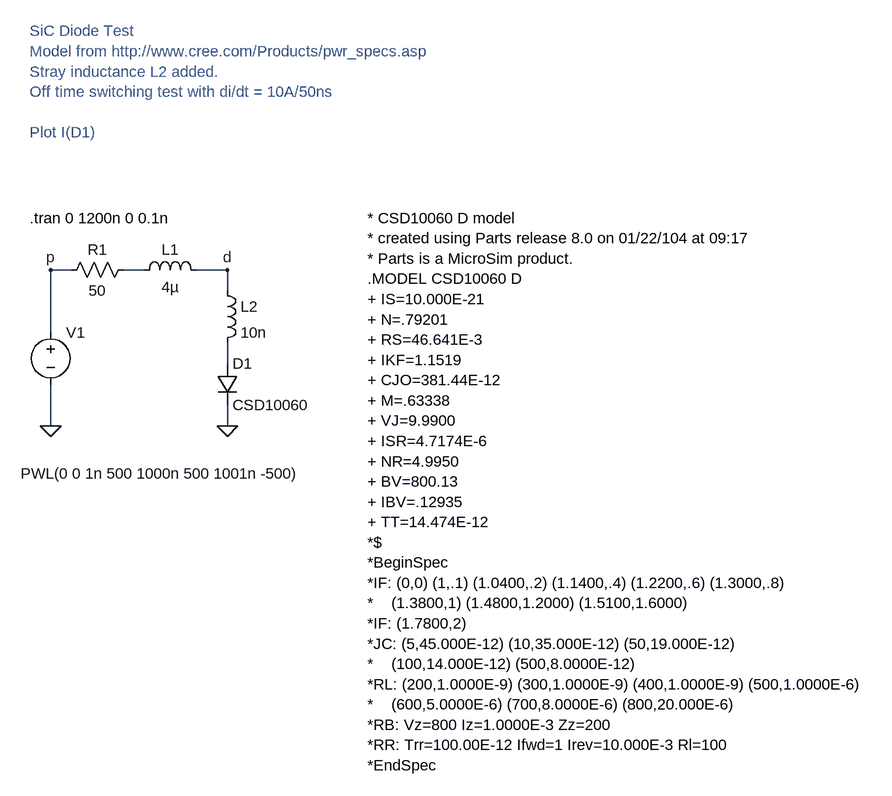
[diagram p0: schematic csd10060_test.asc]
csd10060_test.asc, the LTspice schematic file:
Version 4
SHEET 1 1156 820
WIRE 80 224 80 256
WIRE 80 160 80 128
WIRE 80 16 32 16
WIRE -160 16 -192 16
WIRE -192 16 -192 112
WIRE -192 192 -192 256
WIRE -48 16 -80 16
WIRE 80 48 80 16
FLAG 80 256 0
FLAG -192 256 0
FLAG 80 16 d
FLAG -192 16 p
SYMBOL diode 64 160 R0
SYMATTR InstName D1
SYMATTR Value CSD10060
SYMBOL res -176 32 R270
WINDOW 0 32 56 VTop 0
WINDOW 3 0 56 VBottom 0
SYMATTR InstName R1
SYMATTR Value 50
SYMBOL voltage -192 96 R0
WINDOW 3 -46 233 Left 0
WINDOW 123 0 0 Left 0
WINDOW 39 0 0 Left 0
SYMATTR Value PWL(0 0 1n 500 1000n 500 1001n -500)
SYMATTR InstName V1
SYMBOL ind -64 32 R270
WINDOW 0 32 56 VTop 0
WINDOW 3 5 56 VBottom 0
SYMATTR InstName L1
SYMATTR Value 4µ
SYMBOL ind 64 32 R0
SYMATTR InstName L2
SYMATTR Value 10n
TEXT 296 -64 Left 0 !* CSD10060 D model\n* created using Parts release 8.0 on 01/22/104 at 09:17\n* Parts is a MicroSim product.\n.MODEL CSD10060 D\n+ IS=10.000E-21\n+ N=.79201\n+ RS=46.641E-3\n+ IKF=1.1519\n+ CJO=381.44E-12\n+ M=.63338\n+ VJ=9.9900\n+ ISR=4.7174E-6\n+ NR=4.9950\n+ BV=800.13\n+ IBV=.12935\n+ TT=14.474E-12\n*$\n*BeginSpec\n*IF: (0,0) (1,.1) (1.0400,.2) (1.1400,.4) (1.2200,.6) (1.3000,.8) \n*    (1.3800,1) (1.4800,1.2000) (1.5100,1.6000)\n*IF: (1.7800,2)\n*JC: (5,45.000E-12) (10,35.000E-12) (50,19.000E-12) \n*    (100,14.000E-12) (500,8.0000E-12)\n*RL: (200,1.0000E-9) (300,1.0000E-9) (400,1.0000E-9) (500,1.0000E-6)\n*    (600,5.0000E-6) (700,8.0000E-6) (800,20.000E-6)\n*RB: Vz=800 Iz=1.0000E-3 Zz=200\n*RR: Trr=100.00E-12 Ifwd=1 Irev=10.000E-3 Rl=100\n*EndSpec
TEXT -224 -64 Left 0 !.tran 0 1200n 0 0.1n
TEXT -224 -352 Left 0 ;SiC Diode Test\nModel from http://www.cree.com/Products/pwr_specs.asp\nStray inductance L2 added.\nOff time switching test with di/dt = 10A/50ns\n \nPlot I(D1)

The netlist it stands for:
* csd10060_test.asc
D1 N001 0 CSD10060
R1 p N002 50
V1 p 0 PWL(0 0 1n 500 1000n 500 1001n -500)
L1 N002 d 4µ
L2 d N001 10n
.model D D
.lib standard.dio
* CSD10060 D model
* created using Parts release 8.0 on 01/22/104 at 09:17
* Parts is a MicroSim product.
.MODEL CSD10060 D
+ IS=10.000E-21
+ N=.79201
+ RS=46.641E-3
+ IKF=1.1519
+ CJO=381.44E-12
+ M=.63338
+ VJ=9.9900
+ ISR=4.7174E-6
+ NR=4.9950
+ BV=800.13
+ IBV=.12935
+ TT=14.474E-12
*$
*BeginSpec
*IF: (0,0) (1,.1) (1.0400,.2) (1.1400,.4) (1.2200,.6) (1.3000,.8)
*    (1.3800,1) (1.4800,1.2000) (1.5100,1.6000)
*IF: (1.7800,2)
*JC: (5,45.000E-12) (10,35.000E-12) (50,19.000E-12)
*    (100,14.000E-12) (500,8.0000E-12)
*RL: (200,1.0000E-9) (300,1.0000E-9) (400,1.0000E-9) (500,1.0000E-6)
*    (600,5.0000E-6) (700,8.0000E-6) (800,20.000E-6)
*RB: Vz=800 Iz=1.0000E-3 Zz=200
*RR: Trr=100.00E-12 Ifwd=1 Irev=10.000E-3 Rl=100
*EndSpec
.tran 0 1200n 0 0.1n
* SiC Diode Test
* Model from http://www.cree.com/Products/pwr_specs.asp
* Stray inductance L2 added.
* Off time switching test with di/dt = 10A/50ns
* Plot I(D1)
.backanno
.end